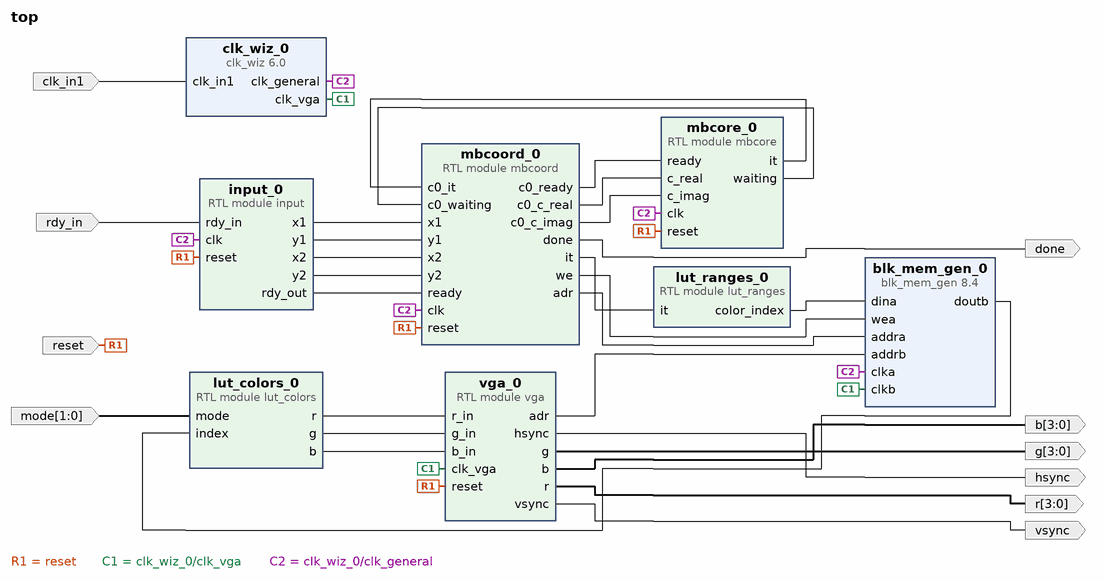
[diagram p0: block diagram of the top level]
# Vivado block design top, xc7a35tcpg236-1, Vivado 2018.3
create_bd_design top

create_bd_port -dir I -type rst reset
set_property -dict {CONFIG.POLARITY ACTIVE_HIGH} [get_bd_ports reset]
create_bd_port -dir O hsync
create_bd_port -dir O vsync
create_bd_port -dir O -from 3 -to 0 r
create_bd_port -dir O -from 3 -to 0 g
create_bd_port -dir O -from 3 -to 0 b
create_bd_port -dir I -type clk clk_in1
set_property -dict {CONFIG.CLK_DOMAIN top_clk CONFIG.FREQ_HZ 100000000} [get_bd_ports clk_in1]
create_bd_port -dir O done
create_bd_port -dir I rdy_in
create_bd_port -dir I -from 1 -to 0 mode

create_bd_cell -type ip -vlnv xilinx.com:ip:blk_mem_gen:8.4 blk_mem_gen_0
set_property -dict [list \
  CONFIG.Additional_Inputs_for_Power_Estimation false \
  CONFIG.Assume_Synchronous_Clk false \
  CONFIG.Enable_32bit_Address false \
  CONFIG.Enable_A Always_Enabled \
  CONFIG.Enable_B Always_Enabled \
  CONFIG.Fill_Remaining_Memory_Locations false \
  CONFIG.Load_Init_File false \
  CONFIG.Memory_Type Simple_Dual_Port_RAM \
  CONFIG.Operating_Mode_A READ_FIRST \
  CONFIG.Port_B_Clock 100 \
  CONFIG.Port_B_Enable_Rate 100 \
  CONFIG.Read_Width_B 3 \
  CONFIG.Register_PortB_Output_of_Memory_Primitives false \
  CONFIG.Use_Byte_Write_Enable false \
  CONFIG.Write_Depth_A 480000 \
  CONFIG.Write_Width_A 3 \
  CONFIG.Write_Width_B 3 \
  CONFIG.use_bram_block Stand_Alone \
] [get_bd_cells blk_mem_gen_0]
create_bd_cell -type ip -vlnv xilinx.com:ip:clk_wiz:6.0 clk_wiz_0
set_property -dict [list \
  CONFIG.CLKOUT1_JITTER 145.943 \
  CONFIG.CLKOUT1_PHASE_ERROR 94.994 \
  CONFIG.CLKOUT1_REQUESTED_OUT_FREQ 50 \
  CONFIG.CLKOUT2_JITTER 163.613 \
  CONFIG.CLKOUT2_PHASE_ERROR 94.994 \
  CONFIG.CLKOUT2_REQUESTED_OUT_FREQ 30 \
  CONFIG.CLKOUT2_USED true \
  CONFIG.CLK_OUT1_PORT clk_vga \
  CONFIG.CLK_OUT2_PORT clk_general \
  CONFIG.ENABLE_CLOCK_MONITOR false \
  CONFIG.MMCM_CLKFBOUT_MULT_F 10.500 \
  CONFIG.MMCM_CLKOUT0_DIVIDE_F 21.000 \
  CONFIG.MMCM_CLKOUT1_DIVIDE 35 \
  CONFIG.MMCM_DIVCLK_DIVIDE 1 \
  CONFIG.NUM_OUT_CLKS 2 \
  CONFIG.PRIMITIVE MMCM \
  CONFIG.USE_LOCKED false \
  CONFIG.USE_RESET false \
] [get_bd_cells clk_wiz_0]
create_bd_cell -type module -reference lut_colors lut_colors_0
create_bd_cell -type module -reference lut_ranges lut_ranges_0
create_bd_cell -type module -reference mbcoord mbcoord_0
create_bd_cell -type module -reference mbcore mbcore_0
create_bd_cell -type module -reference vga vga_0
create_bd_cell -type module -reference input input_0

# ---- connections ----

connect_bd_net [get_bd_ports reset] [get_bd_pins mbcoord_0/reset] [get_bd_pins mbcore_0/reset] [get_bd_pins vga_0/reset] [get_bd_pins input_0/reset]
connect_bd_net [get_bd_pins vga_0/hsync] [get_bd_ports hsync]
connect_bd_net [get_bd_pins vga_0/r] [get_bd_ports r]
connect_bd_net [get_bd_pins vga_0/g] [get_bd_ports g]
connect_bd_net [get_bd_pins vga_0/b] [get_bd_ports b]
connect_bd_net [get_bd_pins vga_0/vsync] [get_bd_ports vsync]
connect_bd_net [get_bd_pins blk_mem_gen_0/doutb] [get_bd_pins lut_colors_0/index]
connect_bd_net [get_bd_pins lut_colors_0/r] [get_bd_pins vga_0/r_in]
connect_bd_net [get_bd_pins lut_colors_0/g] [get_bd_pins vga_0/g_in]
connect_bd_net [get_bd_pins lut_colors_0/b] [get_bd_pins vga_0/b_in]
connect_bd_net [get_bd_pins vga_0/adr] [get_bd_pins blk_mem_gen_0/addrb]
connect_bd_net [get_bd_pins clk_wiz_0/clk_vga] [get_bd_pins blk_mem_gen_0/clkb] [get_bd_pins vga_0/clk_vga]
connect_bd_net [get_bd_pins lut_ranges_0/color_index] [get_bd_pins blk_mem_gen_0/dina]
connect_bd_net [get_bd_ports rdy_in] [get_bd_pins input_0/rdy_in]
connect_bd_net [get_bd_pins mbcore_0/it] [get_bd_pins mbcoord_0/c0_it]
connect_bd_net [get_bd_pins mbcore_0/waiting] [get_bd_pins mbcoord_0/c0_waiting]
connect_bd_net [get_bd_pins mbcoord_0/c0_ready] [get_bd_pins mbcore_0/ready]
connect_bd_net [get_bd_pins mbcoord_0/c0_c_real] [get_bd_pins mbcore_0/c_real]
connect_bd_net [get_bd_pins mbcoord_0/c0_c_imag] [get_bd_pins mbcore_0/c_imag]
connect_bd_net [get_bd_pins mbcoord_0/it] [get_bd_pins lut_ranges_0/it]
connect_bd_net [get_bd_pins mbcoord_0/we] [get_bd_pins blk_mem_gen_0/wea]
connect_bd_net [get_bd_pins mbcoord_0/adr] [get_bd_pins blk_mem_gen_0/addra]
connect_bd_net [get_bd_pins mbcoord_0/done] [get_bd_ports done]
connect_bd_net [get_bd_pins input_0/x1] [get_bd_pins mbcoord_0/x1]
connect_bd_net [get_bd_pins input_0/y1] [get_bd_pins mbcoord_0/y1]
connect_bd_net [get_bd_pins input_0/x2] [get_bd_pins mbcoord_0/x2]
connect_bd_net [get_bd_pins input_0/y2] [get_bd_pins mbcoord_0/y2]
connect_bd_net [get_bd_pins input_0/rdy_out] [get_bd_pins mbcoord_0/ready]
connect_bd_net -net clk_in1_1 [get_bd_ports clk_in1] [get_bd_pins clk_wiz_0/clk_in1]
connect_bd_net [get_bd_pins clk_wiz_0/clk_general] \
  [get_bd_pins blk_mem_gen_0/clka] [get_bd_pins mbcoord_0/clk] [get_bd_pins mbcore_0/clk] [get_bd_pins input_0/clk]
connect_bd_net [get_bd_ports mode] [get_bd_pins lut_colors_0/mode]

validate_bd_design
save_bd_design
